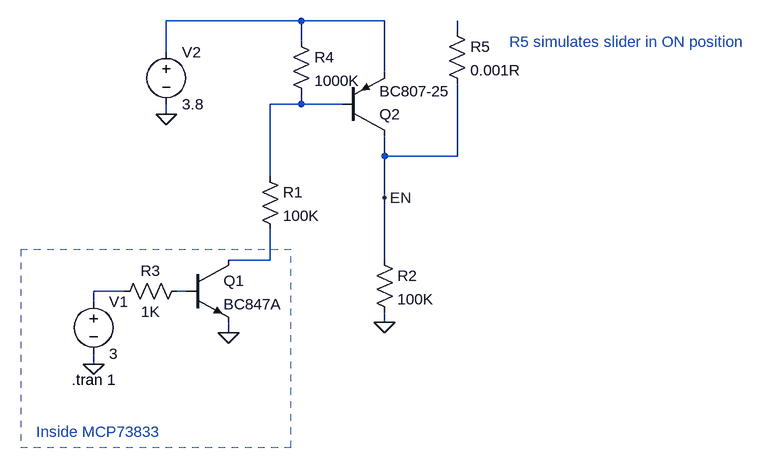
[diagram p0: schematic power_switching.asc]
power_switching.asc, the LTspice schematic file:
Version 4
SHEET 1 880 788
WIRE 144 128 -64 128
WIRE 272 128 144 128
WIRE 384 144 384 128
WIRE 144 160 144 128
WIRE -64 176 -64 128
WIRE 272 208 272 128
WIRE 144 256 144 240
WIRE 144 256 96 256
WIRE 208 256 144 256
WIRE -64 272 -64 256
WIRE 272 336 272 304
WIRE 384 336 384 224
WIRE 384 336 272 336
WIRE 96 368 96 256
WIRE 272 400 272 336
WIRE 96 496 96 448
WIRE 96 496 32 496
WIRE 272 496 272 400
WIRE -128 544 -176 544
WIRE -32 544 -48 544
WIRE -176 560 -176 544
WIRE 272 592 272 576
WIRE 32 608 32 592
WIRE -176 656 -176 640
FLAG 32 608 0
FLAG 272 592 0
FLAG -176 656 0
FLAG -64 272 0
FLAG 272 400 EN
SYMBOL npn -32 496 R0
SYMATTR InstName Q1
SYMATTR Value BC847A
SYMBOL res 80 352 R0
SYMATTR InstName R1
SYMATTR Value 100K
SYMBOL pnp 208 304 M180
SYMATTR InstName Q2
SYMATTR Value BC807-25
SYMBOL res 256 480 R0
SYMATTR InstName R2
SYMATTR Value 100K
SYMBOL res -32 528 R90
WINDOW 0 0 56 VBottom 2
WINDOW 3 32 56 VTop 2
SYMATTR InstName R3
SYMATTR Value 1K
SYMBOL voltage -176 544 R0
WINDOW 123 0 0 Left 2
WINDOW 39 0 0 Left 2
SYMATTR InstName V1
SYMATTR Value 3
SYMBOL voltage -64 160 R0
WINDOW 123 0 0 Left 2
WINDOW 39 0 0 Left 2
SYMATTR InstName V2
SYMATTR Value 3.8
SYMBOL res 128 144 R0
SYMATTR InstName R4
SYMATTR Value 1000K
SYMBOL res 368 128 R0
SYMATTR InstName R5
SYMATTR Value 0.001R
TEXT -210 680 Left 2 !.tran 1
TEXT -264 760 Left 2 ;Inside MCP73833
TEXT 464 160 Left 2 ;R5 simulates slider in ON position
LINE Normal 128 480 -288 480 2
LINE Normal 128 784 128 480 2
LINE Normal -288 784 128 784 2
LINE Normal -288 480 -288 784 2

The netlist it stands for:
* power_switching.asc
Q1 N004 N006 0 0 BC847A
R1 N003 N004 100K
Q2 EN N003 N001 0 BC807-25
R2 EN 0 100K
R3 N006 N005 1K
V1 N005 0 3
V2 N001 0 3.8
R4 N001 N003 1000K
R5 N002 EN 0.001R
.model NPN NPN
.model PNP PNP
.lib standard.bjt
.tran 1
* Inside MCP73833
* R5 simulates slider in ON position
.backanno
.end